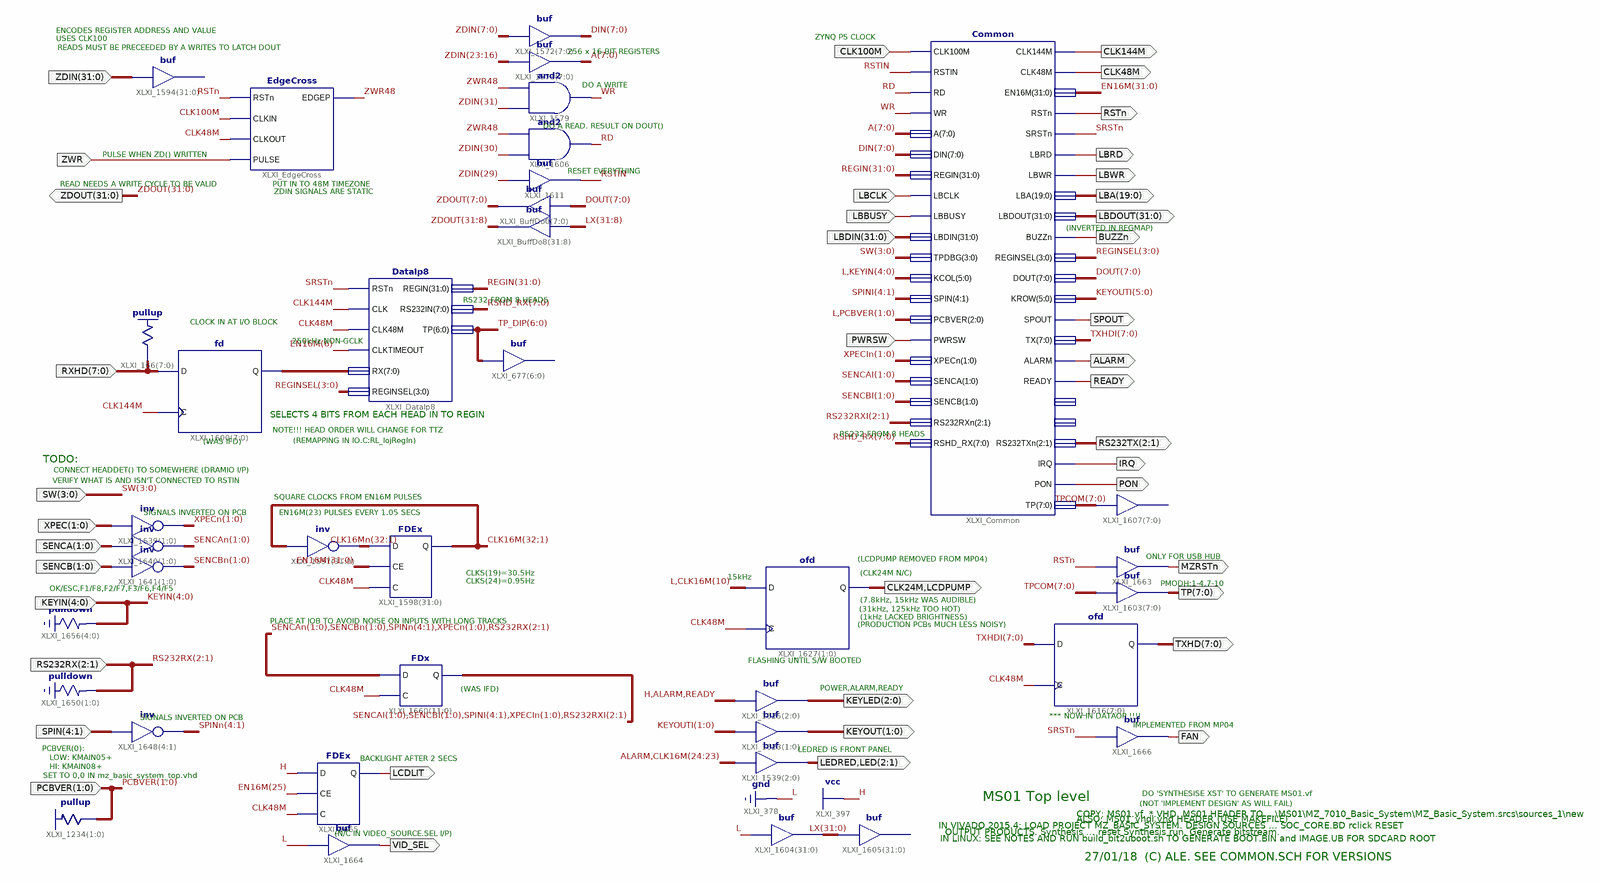
[diagram p0: schematic sheet 1]
// Xilinx ISE schematic MS01.sch (spartan3e) as structural Verilog: 37 symbols, 41 ports
module MS01 (
  input  CLK100M,
  input  [7:0] RXHD,
  input  [1:0] PCBVER,
  input  [31:0] ZDIN,
  input  ZWR,
  input  [4:1] SPIN,
  input  [3:0] SW,
  input  [1:0] XPEC,
  input  [1:0] SENCB,
  input  [1:0] SENCA,
  input  [2:1] RS232RX,
  input  [4:0] KEYIN,
  input  PWRSW,
  input  LBCLK,
  input  LBBUSY,
  input  [31:0] LBDIN,
  output CLK48M,
  output RSTn,
  output CLK144M,
  output [31:0] ZDOUT,
  output SPOUT,
  output BUZZn,
  output LBRD,
  output LBWR,
  output [19:0] LBA,
  output [31:0] LBDOUT,
  output LEDRED,
  output [2:1] LED,
  output [1:0] KEYOUT,
  output [2:0] KEYLED,
  output [2:1] RS232TX,
  output CLK24M,
  output LCDPUMP,
  output VID_SEL,
  output LCDLIT,
  output [7:0] TXHD,
  output [7:0] TP,
  output MZRSTn,
  output ALARM,
  output READY,
  output IRQ,
  output PON,
  output FAN
);

  wire RD, RSTIN, SRSTn, WR, ZWR48;
  wire [1:0] SENCAI, SENCAn, SENCBI, SENCBn, XPECIn, XPECn;
  wire [2:1] RS232RXI;
  wire [3:0] REGINSEL;
  wire [4:1] SPINI, SPINn;
  wire [5:0] KEYOUTI;
  wire [6:0] TP_DIP;
  wire [7:0] A, DIN, DOUT, RSHD_RX, TPCOM, TXHDI, XLXN_33;
  wire [31:0] EN16M, LX, REGIN;
  wire [32:1] CLK16M, CLK16Mn;

  \pullup  XLXI_166[7:0] (.O(RXHD));
  \pullup  XLXI_1234[1:0] (.O(PCBVER));
  assign DIN = ZDIN[7:0];  // buf XLXI_1572[7..0], 8 bits wide
  assign A = ZDIN[23:16];  // buf XLXI_1573[7..0], 8 bits wide
  and XLXI_1579 (WR, ZDIN[31], ZWR48);
  EdgeCross XLXI_EdgeCross (.CLKIN(CLK100M), .CLKOUT(CLK48M), .EDGEP(ZWR48), .PULSE(ZWR), .RSTn(RSTn));
  // buf XLXI_1594[31..0] has open pins: I=ZDIN, O=open
  fd XLXI_1600[7:0] (.C(CLK144M), .D(RXHD), .Q(XLXN_33));
  and XLXI_1606 (RD, ZDIN[30], ZWR48);
  assign LX = {32{1'b0}};  // buf XLXI_1604[31..0], 32 bits wide
  // buf XLXI_1605[31..0] has open pins: I=LX, O=open
  assign ZDOUT[7:0] = DOUT;  // buf XLXI_BuffDo0[7..0], 8 bits wide
  assign ZDOUT[31:8] = LX[31:8];  // buf XLXI_BuffDo8[31..8], 24 bits wide
  buf XLXI_1611 (RSTIN, ZDIN[29]);
  assign {LEDRED, LED} = {ALARM, CLK16M[24:23]};  // buf XLXI_1539[2..0], 3 bits wide
  assign KEYOUT = KEYOUTI[1:0];  // buf XLXI_1623[1..0], 2 bits wide
  assign KEYLED = {1'b1, ALARM, READY};  // buf XLXI_1625[2..0], 3 bits wide
  assign SPINn = ~SPIN;  // inv XLXI_1648[4..1], 4 bits wide
  assign XPECn = ~XPEC;  // inv XLXI_1639[1..0], 2 bits wide
  assign SENCAn = ~SENCA;  // inv XLXI_1640[1..0], 2 bits wide
  assign SENCBn = ~SENCB;  // inv XLXI_1641[1..0], 2 bits wide
  ofd XLXI_1627[1:0] (.C(CLK48M), .D({1'b0, CLK16M[10]}), .Q({CLK24M, LCDPUMP}));
  \pulldown  XLXI_1650[1:0] (.O(RS232RX));
  \pulldown  XLXI_1656[4:0] (.O(KEYIN));
  FDx XLXI_1660[11:0] (
    .C(CLK48M), .D({SENCAn, SENCBn, SPINn, XPECn, RS232RX}), .Q({SENCAI, SENCBI, SPINI, XPECIn, RS232RXI}));
  buf XLXI_1664 (VID_SEL, 1'b0);
  FDEx XLXI_1665 (.C(CLK48M), .CE(EN16M[25]), .D(1'b1), .Q(LCDLIT));
  ofd XLXI_1616[7:0] (.C(CLK48M), .D(TXHDI), .Q(TXHD));
  assign TP = TPCOM;  // buf XLXI_1603[7..0], 8 bits wide
  buf XLXI_1663 (MZRSTn, RSTn);
  DataIp8 XLXI_DataIp8 (
    .CLK(CLK144M), .CLK48M(CLK48M), .CLKTIMEOUT(EN16M[6]), .REGIN(REGIN), .REGINSEL(REGINSEL),
    .RS232IN(RSHD_RX), .RSTn(SRSTn), .RX(XLXN_33), .TP(TP_DIP));
  // buf XLXI_677[6..0] has open pins: I=TP_DIP, O=open
  Common XLXI_Common (
    .A(A), .ALARM(ALARM), .BUZZn(BUZZn), .CLK100M(CLK100M), .CLK144M(CLK144M), .CLK48M(CLK48M), .DIN(DIN),
    .DOUT(DOUT), .EN16M(EN16M), .IRQ(IRQ), .KCOL({1'b0, KEYIN}), .KROW(KEYOUTI), .LBA(LBA), .LBBUSY(LBBUSY),
    .LBCLK(LBCLK), .LBDIN(LBDIN), .LBDOUT(LBDOUT), .LBRD(LBRD), .LBWR(LBWR), .PCBVER({1'b0, PCBVER}),
    .PON(PON), .PWRSW(PWRSW), .RD(RD), .READY(READY), .REGIN(REGIN), .REGINSEL(REGINSEL),
    .RS232RXn(RS232RXI), .RS232TXn(RS232TX), .RSHD_RX(RSHD_RX), .RSTIN(RSTIN), .RSTn(RSTn), .SENCA(SENCAI),
    .SENCB(SENCBI), .SPIN(SPINI), .SPOUT(SPOUT), .SRSTn(SRSTn), .TP(TPCOM), .TPDBG(SW), .TX(TXHDI), .WR(WR),
    .XPECn(XPECIn));  // open: XCONFIG, FIRE_EN
  // buf XLXI_1607[7..0] has open pins: I=TPCOM, O=open
  assign CLK16Mn = ~CLK16M;  // inv XLXI_1597[31..0], 32 bits wide
  FDEx XLXI_1598[31:0] (.C(CLK48M), .CE(EN16M), .D(CLK16Mn), .Q(CLK16M));
  buf XLXI_1666 (FAN, SRSTn);

  // Notes on the sheet:
  //   ENCODES REGISTER ADDRESS AND VALUE
  //   ZYNQ PS CLOCK
  //   USES CLK100
  //   READS MUST BE PRECEEDED BY A WRITES TO LATCH DOUT
  //   256 x 16 BIT REGISTERS
  //   DO A WRITE
  //   DO A READ. RESULT ON DOUT()
  //   PULSE WHEN ZD() WRITTEN
  //   RESET EVERYTHING
  //   READ NEEDS A WRITE CYCLE TO BE VALID
  //   PUT IN TO 48M TIMEZONE
  //   ZDIN SIGNALS ARE STATIC
  //   (INVERTED IN REGMAP)
  //   RS232 FROM 8 HEADS
  //   CLOCK IN AT I/O BLOCK
  //   250kHz NON-GCLK
  //   SELECTS 4 BITS FROM EACH HEAD IN TO REGIN
  //   NOTE!!! HEAD ORDER WILL CHANGE FOR TTZ
  //   RS232 FROM 8 HEADS
  //   (REMAPPING IN IO.C:RL_IojRegIn)
  //   (WAS IFD)
  //   TODO:
  //   CONNECT HEADDET() TO SOMEWHERE (DRAMIO I/P)
  //   VERIFY WHAT IS AND ISN'T CONNECTED TO RSTIN
  //   SQUARE CLOCKS FROM EN16M PULSES
  //   SIGNALS INVERTED ON PCB
  //   EN16M(23) PULSES EVERY 1.05 SECS
  //   ONLY FOR USB HUB
  //   (LCDPUMP REMOVED FROM MP04)
  //   CLKS(19)=30.5Hz
  //   (CLK24M N/C)
  //   15kHz
  //   CLKS(24)=0.95Hz
  //   PMODH:1-4,7-10
  //   OK/ESC,F1/F8,F2/F7,F3/F6,F4/F5
  //   (7.8kHz, 15kHz WAS AUDIBLE)
  //   (31kHz, 125kHz TOO HOT)
  //   (1kHz LACKED BRIGHTNESS)
  //   PLACE AT IOB TO AVOID NOISE ON INPUTS WITH LONG TRACKS
  //   (PRODUCTION PCBs MUCH LESS NOISY)
  //   FLASHING UNTIL S/W BOOTED
  //   POWER,ALARM,READY
  //   (WAS IFD)
  //   *** NOW IN DATAOP !!!!
  //   SIGNALS INVERTED ON PCB
  //   IMPLEMENTED FROM MP04
  //   PCBVER(0):
  //   LEDRED IS FRONT PANEL
  //   LOW: KMAIN05+
  //   BACKLIGHT AFTER 2 SECS
  //   HI: KMAIN08+
  //   SET TO 0,0 IN mz_basic_system_top.vhd
  //   DO 'SYNTHESISE XST' TO GENERATE MS01.vf
  //   MS01 Top level
  //   (NOT 'IMPLEMENT DESIGN' AS WILL FAIL)
  //   COPY: MS01.vf, *.VHD, MS01 HEADER TO ...\MS01\MZ_7010_Basic_System\MZ_Basic_System.srcs\sources_1\new
  //   ALSO: MS01_vhdl.vhd HEADER (USE MAKEFILE)
  //   IN VIVADO 2015.4: LOAD PROJECT MZ_BASIC_SYSTEM. DESIGN SOURCES ... SOC_CORE.BD rclick RESET
  //   OUTPUT PRODUCTS. Synthesis ... reset Synthesis run. Generate bitstream.
  //   (N/C IN VIDEO_SOURCE.SEL I/P)
  //   IN LINUX: SEE NOTES AND RUN build_bit2uboot.sh TO GENERATE BOOT.BIN and IMAGE.UB FOR SDCARD ROOT
  //   27/01/18  (C) ALE. SEE COMMON.SCH FOR VERSIONS
endmodule
